# EAGLE design power-shield-v210 (EAGLE 7.2.0)
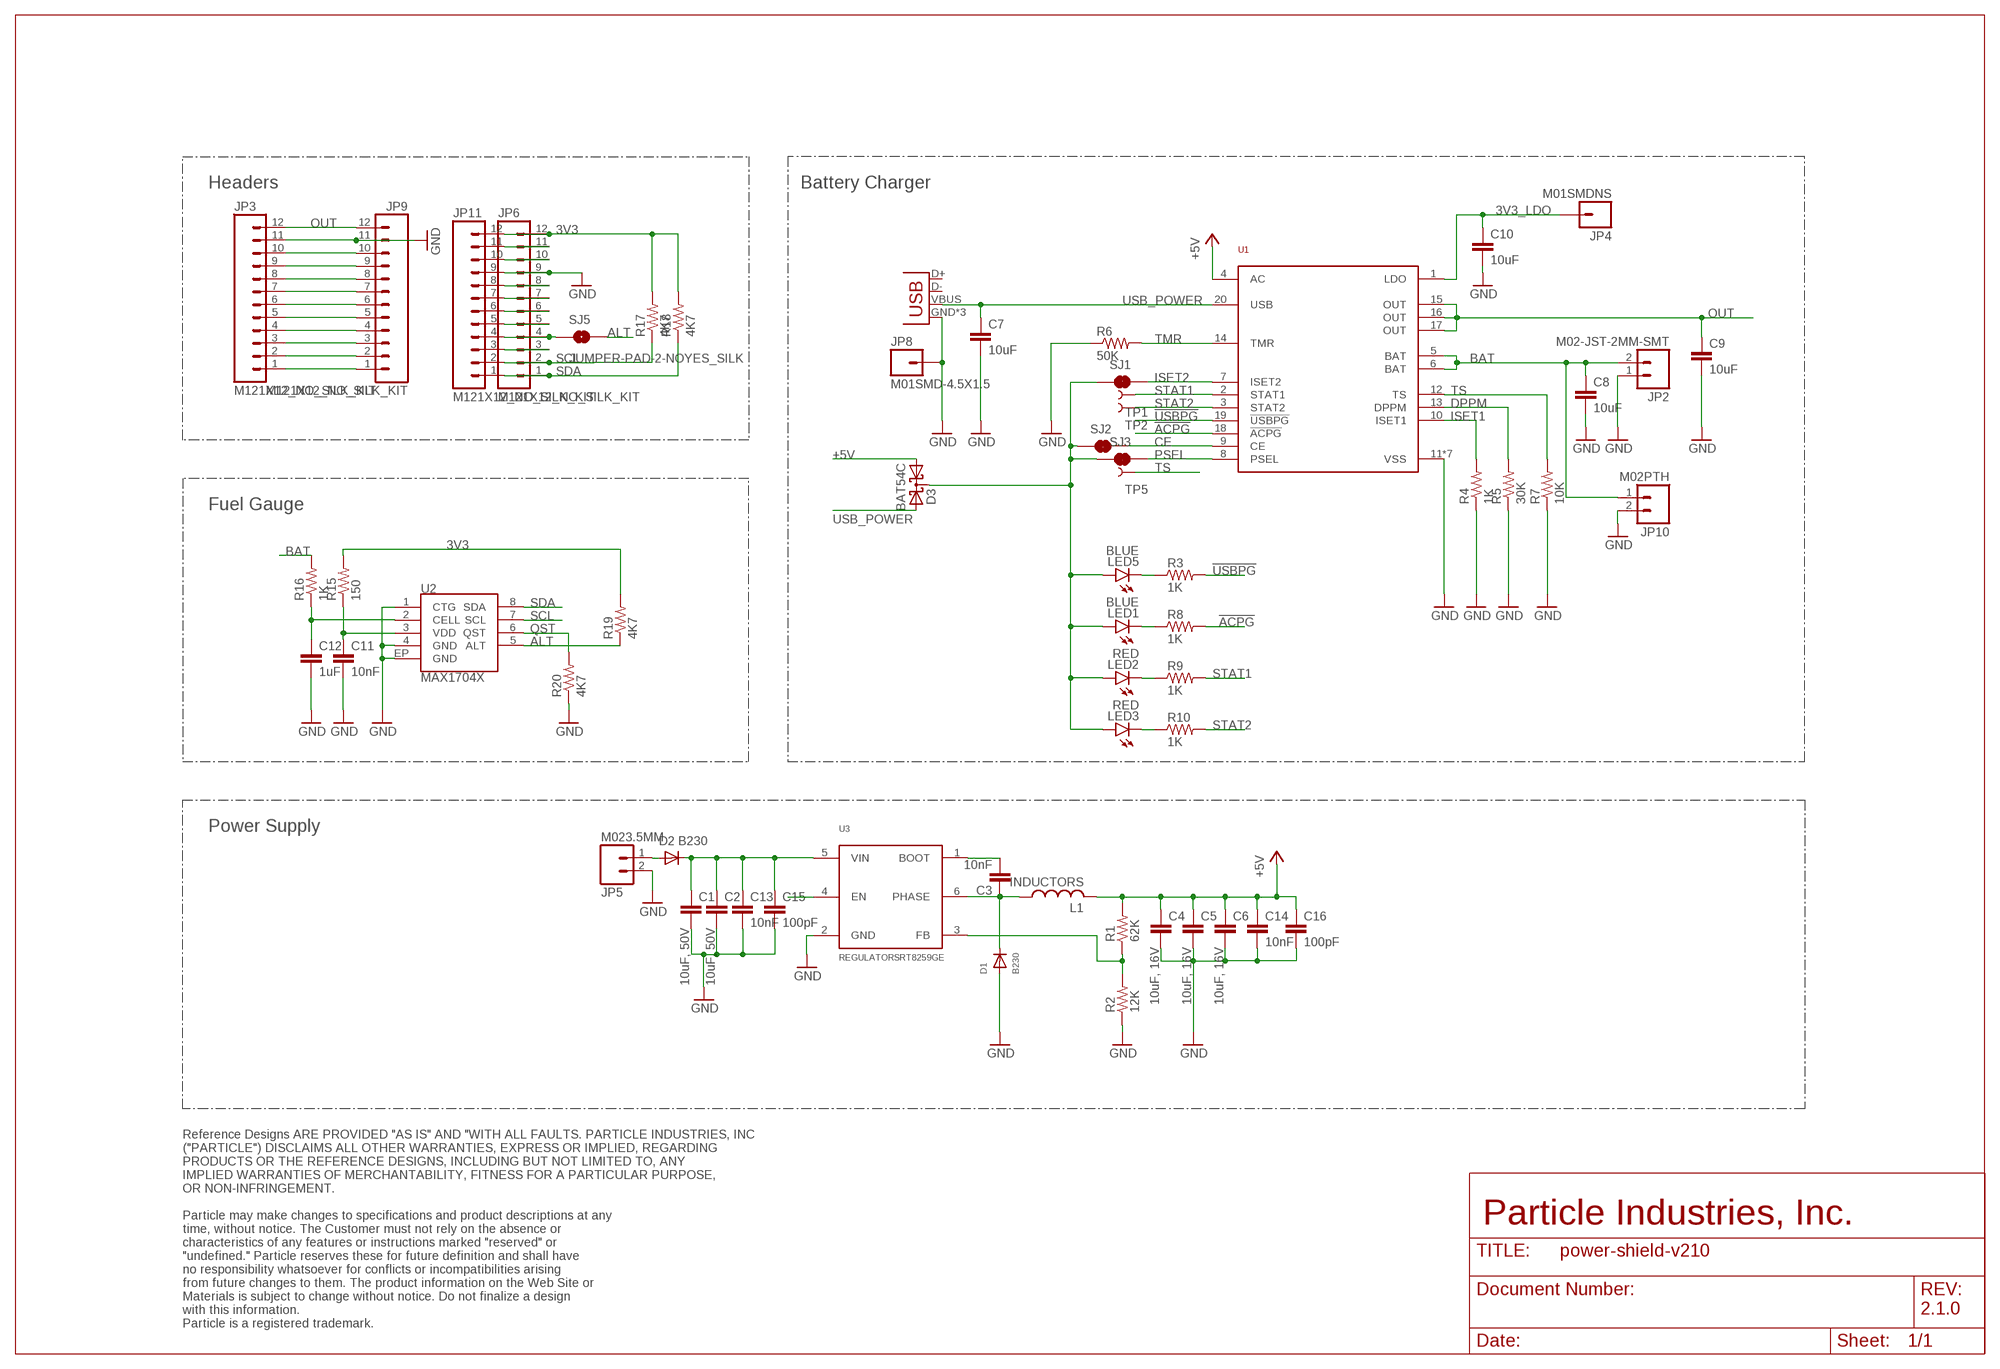
[diagram p0: schematic, sheet 1]

## Parts
C1  10uF, 50V  CAP1206  [1206]
C2  10uF, 50V  CAP1206  [1206]
C3  10nF  CAP0402-CAP  [0402-CAP]
C4  10uF, 16V  CAP1206  [1206]
C5  10uF, 16V  CAP1206  [1206]
C6  10uF, 16V  CAP1206  [1206]
C7  10uF  CAP0603-CAP  [0603-CAP]
C8  10uF  CAP0603-CAP  [0603-CAP]
C9  10uF  CAP0603-CAP  [0603-CAP]
C10  10uF  CAP0603-CAP  [0603-CAP]
C11  10nF  CAP0402-CAP  [0402-CAP]
C12  1uF  CAP0402-CAP  [0402-CAP]
C13  10nF  CAP0402-CAP  [0402-CAP]
C14  10nF  CAP0402-CAP  [0402-CAP]
C15  100pF  CAP0402-CAP  [0402-CAP]
C16  100pF  CAP0402-CAP  [0402-CAP]
D1  B230  DIODESMA  [SMADIODE]
D2  B230  DIODESMA  [SMADIODE]
D3  BAT54C  [SOT23]
JP1  USBUSB-MICROB-SLOT-HOLE  [USB-MICROB-SLOT-HOLE]
JP2  M02-JST-2MM-SMT  [JST-2-SMD]
JP3  M121X12_NO_SILK_KIT  [1X12_NO_SILK_KIT]
JP4  M01SMDNS  [1X01NS]
JP5  M023.5MM  [SCREWTERMINAL-3.5MM-2]
JP6  M121X12_NO_SILK_KIT  [1X12_NO_SILK_KIT]
JP8  M01SMD-4.5X1.5  [PAD-1.5X4.5]
JP9  M121X12_NO_SILK_KIT  [1X12_NO_SILK_KIT]
JP10  M02PTH  [1X02]
JP11  M121X12_NO_SILK_KIT  [1X12_NO_SILK_KIT]
L1  INDUCTORS  [NR8040T6R8N]
LED1  BLUE  LED0603  [LED-0603]
LED2  RED  LED0603  [LED-0603]
LED3  RED  LED0603  [LED-0603]
LED5  BLUE  LED0603  [LED-0603]
R1  62K  RESISTOR0603-RES  [0603-RES]
R2  12K  RESISTOR0603-RES  [0603-RES]
R3  1K  RESISTOR0402-RES  [0402-RES]
R4  1K  RESISTOR0402-RES  [0402-RES]
R5  30K  RESISTOR0402-RES  [0402-RES]
R6  50K  RESISTOR0402-RES  [0402-RES]
R7  10K  RESISTOR0402-RES  [0402-RES]
R8  1K  RESISTOR0402-RES  [0402-RES]
R9  1K  RESISTOR0402-RES  [0402-RES]
R10  1K  RESISTOR0402-RES  [0402-RES]
R15  150  RESISTOR0603-RES  [0603-RES]
R16  1K  RESISTOR0603-RES  [0603-RES]
R17  4K7  RESISTOR0402-RES  [0402-RES]
R18  4K7  RESISTOR0402-RES  [0402-RES]
R19  4K7  RESISTOR0402-RES  [0402-RES]
R20  4K7  RESISTOR0402-RES  [0402-RES]
SJ1  JUMPER-PAD-2-NC_BY_TRACE  [PAD-JUMPER-2-NC_BY_TRACE_YES_SILK]
SJ2  JUMPER-PAD-2-NC_BY_TRACE  [PAD-JUMPER-2-NC_BY_TRACE_YES_SILK]
SJ3  JUMPER-PAD-2-NC_BY_TRACE  [PAD-JUMPER-2-NC_BY_TRACE_YES_SILK]
SJ5  JUMPER-PAD-2-NOYES_SILK  [PAD-JUMPER-2-NO_YES_SILK]
TP1  TEST-POINT3  [PAD.03X.03]
TP2  TEST-POINT3  [PAD.03X.03]
TP5  TEST-POINT3  [PAD.03X.03]
U1  BQ24030BQ24030  [R-PVQFN-N20]
U2  MAX1704X  [TDFN-8]
U3  REGULATORSRT8259GE  [SOT23-6]

## Nets
3V3: JP6.12 JP11.12 R15.2 R17.2 R18.2 R19.2
3V3_LDO: C10.1 JP4.1 U1.1(LDO)
!ACPG: R8.2 U1.18(!ACPG)
!USBPG: R3.2 U1.19(!USBPG)
+5V: C4.1 C5.1 C6.1 C14.1 C16.1 D3.1(A1) L1.P$2 R1.2 U1.4(AC)
ALT: R19.1 SJ5.2 U2.5(ALT)
BAT: C8.1 JP2.2 JP10.1 R16.2 U1.5(BAT) U1.6(BAT)
CE: SJ2.2 U1.9(CE)
DPPM: R5.2 U1.13(DPPM)
GND: C1.2 C2.2 C4.2 C5.2 C6.2 C7.2 C8.2 C9.2 C10.2 C11.2 C12.2 C13.2 C14.2 C15.2 C16.2 D1.A JP1.GND JP1.MT1(GND) JP1.MT2(GND) JP2.1 JP3.11 JP5.2 JP6.9 JP8.P$1 JP9.11 JP10.2 JP11.9 R2.1 R4.1 R5.1 R6.1 R7.1 R20.1 U1.11(VSS) U1.21(VSS) U1.22(VSS) U1.23(VSS) U1.24(VSS) U1.25(VSS) U1.26(VSS) U2.1(CTG) U2.4(GND) U2.EP(GND) U3.2(GND)
ISET1: R4.2 U1.10(ISET1)
ISET2: SJ1.2 U1.7(ISET2)
N$1: LED5.C R3.1
N$2: D3.3(CC) LED1.A LED2.A LED3.A LED5.A SJ1.1 SJ2.1 SJ3.1
N$3: LED3.C R10.1
N$4: LED2.C R9.1
N$5: LED1.C R8.1
N$6: JP6.4 JP11.4 SJ5.1
N$7: JP3.1 JP9.1
N$8: JP3.2 JP9.2
N$9: U3.4(EN)
N$10: JP3.3 JP9.3
N$11: C12.1 R16.1 U2.2(CELL)
N$12: C11.1 R15.1 U2.3(VDD)
N$13: JP3.4 JP9.4
N$14: C1.1 C2.1 C13.1 C15.1 D2.C U3.5(VIN)
N$15: JP3.5 JP9.5
N$16: JP3.6 JP9.6
N$17: JP3.7 JP9.7
N$18: JP3.8 JP9.8
N$19: JP3.9 JP9.9
N$20: JP3.10 JP9.10
N$21: JP6.11 JP11.11
N$22: JP6.10 JP11.10
N$23: JP6.8 JP11.8
N$24: JP6.7 JP11.7
N$25: JP6.6 JP11.6
N$26: JP6.5 JP11.5
N$27: JP6.3 JP11.3
N$32: D2.A JP5.1
N$35: C3.1 D1.C L1.P$1 U3.6(PHASE)
N$36: C3.2 U3.1(BOOT)
N$144: R1.1 R2.2 U3.3(FB)
OUT: C9.1 JP3.12 JP9.12 U1.15(OUT) U1.16(OUT) U1.17(OUT)
PSEL: SJ3.2 U1.8(PSEL)
QST: R20.2 U2.6(QST)
SCL: JP6.2 JP11.2 R17.1 U2.7(SCL)
SDA: JP6.1 JP11.1 R18.1 U2.8(SDA)
STAT1: R9.2 TP1.P$1 U1.2(STAT1)
STAT2: R10.2 TP2.P$1 U1.3(STAT2)
TMR: R6.2 U1.14(TMR)
TS: R7.2 TP5.P$1 U1.12(TS)
USB_POWER: C7.1 D3.2(A2) JP1.VBUS U1.20(USB)
Unconnected: JP1.D+ JP1.D-

## Notes on the sheet
- Headers | Battery Charger
- Fuel Gauge
- Power Supply
- Particle Industries, Inc.
- 2.1.0
- Reference Designs ARE PROVIDED "AS IS" AND "WITH ALL FAULTS. PARTICLE INDUSTRIES, INC 
  ("PARTICLE") DISCLAIMS ALL OTHER WARRANTIES, EXPRESS OR IMPLIED, REGARDING 
  PRODUCTS OR THE REFERENCE DESIGNS, INCLUDING BUT NOT LIMITED TO, ANY 
  IMPLIED WARRANTIES OF MERCHANTABILITY, FITNESS FOR A PARTICULAR PURPOSE,
  OR NON-INFRINGEMENT.
  
  Particle may make changes to specifications and product descriptions at any 
  time, without notice. The Customer must not rely on the absence or 
  characteristics of any features or instructions marked "reserved" or 
  "undefined." Particle reserves these for future definition and shall have 
  no responsibility whatsoever for conflicts or incompatibilities arising 
  from future changes to them. The product information on the Web Site or 
  Materials is subject to change without notice. Do not finalize a design 
  with this information. 
  Particle is a registered trademark.

## Library data of the parts
C1-C16 = SparkFun-Capacitors:CAP: Capacitor Standard 0603 ceramic capacitor, and 0.1" leaded capacitor.
D1 D2 = adafruit:DIODE: Diode SMADIODE - SMA Surface Mount Package 20V 1A Schottky Diode Digikey: 641-1014-6-ND DO-1N4148 - Through Hole Small Current Diode SOD-123 20V 1 A (.5mV Vf) Schottky Diode - Digikey: MBRX120TPMSCT-ND SOD-323 10V 570mA (.38mV Vf, 3ns) Schottky Diode - Digikey: ZLLS410CT-ND SOD-523 30V 30mA Schottky Diode (RB751S-40TE61) - Digikey: RB751S-40TE61CT-ND SOT23-R/W - SOT23 Package (R = Solder Paste/Reflow Ovens, W = Hand-Soldering) BAT54Film 40V 300mA - Digikey: 497-7162-1-ND
D3 = diode:BAT54C: Schottky Diodes Source: Fairchild .. BAT54.pdf
JP1 = Spark:USB
JP2 = SparkFun-Connectors:M02: Standard 2-pin 0.1" header. Use with - straight break away headers ( PRT-00116) - right angle break away headers (PRT-00553) - swiss pins (PRT-00743) - machine pins (PRT-00117) - female headers (PRT-00115) Molex polarized connector foot print use with: PRT-08233 with associated crimp pins and housings. 2.54_SCREWTERM for use with PRT-10571. 3.5mm Screw Terminal footprints for PRT-08084 5mm Screw Terminal footprints for use with PRT-08433; PROD_ID: CONN-08352
JP3 JP6 JP9 JP11 = SparkFun-Connectors:M12: Header 12 Standard 12-pin 0.1" header. Use with straight break away headers (SKU : PRT-00116), right angle break away headers (PRT-00553), swiss pins (PRT-00743), machine pins (PRT-00117), and female headers (PRT-00115).
JP4 JP8 = SparkFun-Connectors:M01: Header 1 Standard 1-pin 0.1" header. Use with straight break away headers (SKU : PRT-00116), right angle break away headers (PRT-00553), swiss pins (PRT-00743), machine pins (PRT-00117), and female headers (PRT-00115).
JP5 JP10 = SparkFun-Connectors:M02: Standard 2-pin 0.1" header. Use with - straight break away headers ( PRT-00116) - right angle break away headers (PRT-00553) - swiss pins (PRT-00743) - machine pins (PRT-00117) - female headers (PRT-00115) Molex polarized connector foot print use with: PRT-08233 with associated crimp pins and housings. 2.54_SCREWTERM for use with PRT-10571. 3.5mm Screw Terminal footprints for PRT-08084 5mm Screw Terminal footprints for use with PRT-08433
L1 = mohit-eagle:INDUCTORS
LED1-LED3 LED5 = SparkFun-LED:LED: LEDs Standard schematic elements and footprints for 5mm, 3mm, 1206, and 0603 sized LEDs. 5mm - Spark Fun Electronics SKU : COM-00529 (and others)
R1-R10 R15-R20 = SparkFun-Passives:RESISTOR: Resistor Basic schematic elements and footprints for 0603, 1206, and PTH resistors.
SJ1-SJ3 = mohit-eagle:JUMPER-PAD-2-NC_BY_TRACE
SJ5 = SparkFun-Passives:JUMPER-PAD-2-NO
TP1 TP2 TP5 = SparkFun-Passives:TEST-POINT: Bare copper test points for troubleshooting or ICT
U1 = mohit-eagle:BQ24030
U2 = SparkFun-PowerIC:MAX1704X: MAX17043/MAX17044: Battery Fuel Guage (43 is 1cell, 44 is 2cell)
U3 = mohit-eagle:REGULATORS

## Board
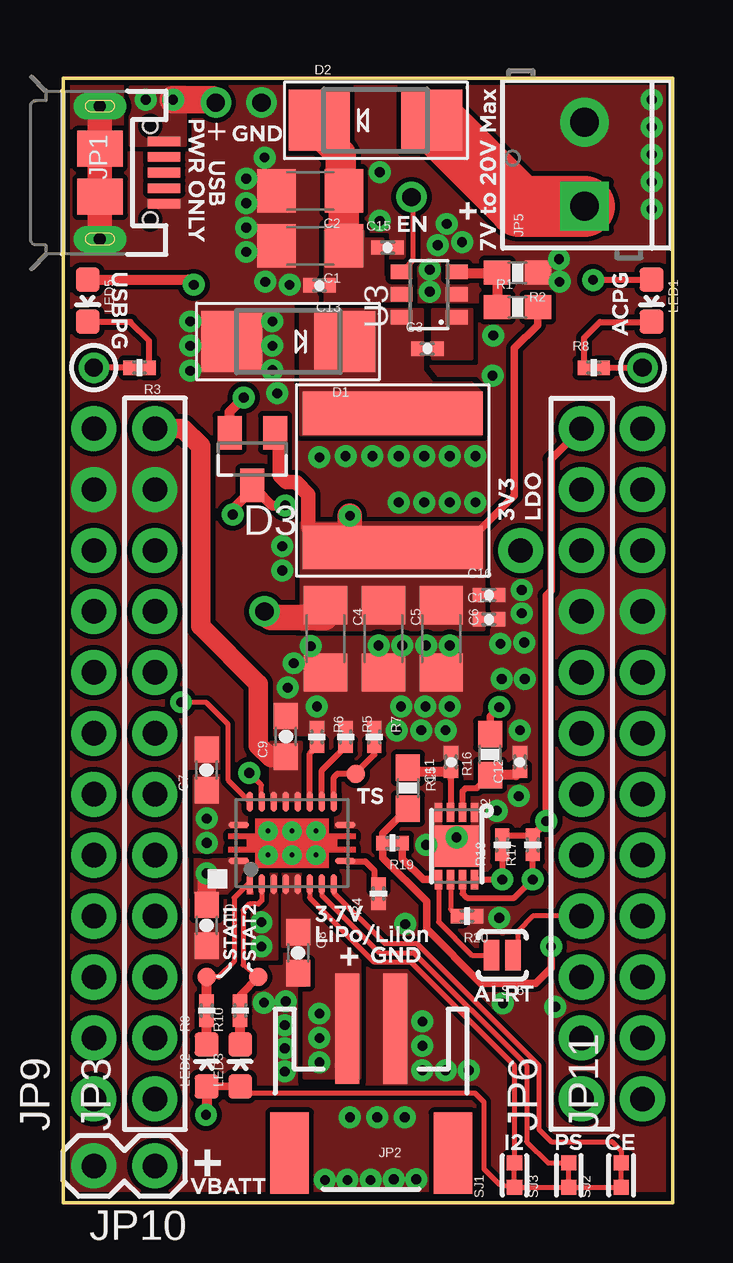
[diagram p1: board, top side]
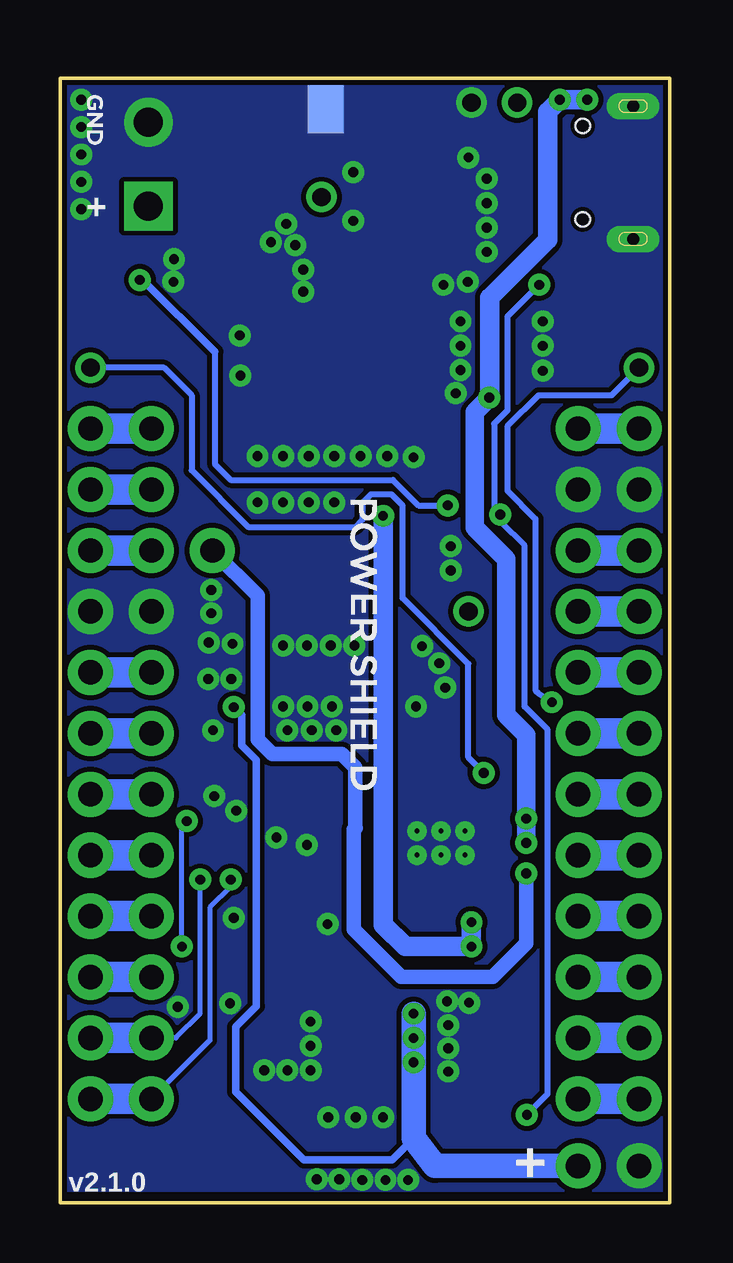
[diagram p2: board, bottom side, seen from below]

Size 25.4 x 46.86 mm. Coordinates in mm from the lower left corner, seen from the top.
Outline: 0,0 0,46.86 25.4,46.86 25.4,0 0,0
Copper layers (1*16): Top 0.035mm / dielectric 1.5mm / Bottom 0.035mm
Design rules "SparkFun-2-layer": minimum track width 7mil, minimum drill 15mil, track to track 8mil, track to pad 8mil, pad to pad 8mil, via to via 8mil, smd to smd 8mil, copper to edge 8mil, drill to drill 8mil, minimum pad ring 12mil, minimum via ring 10mil, stop-mask expansion 4mil, vias tented up to drill 20mil, thermal gap 10mil

### Footprints (pad centres in the part's own frame; a part is rotated, then mirrored left to right if it is on the bottom)
1206 = smd 1.6 x 1.8: 1 -1.4,0; 2 1.4,0
0402-CAP = smd 0.55 x 0.6: 1 -0.4,0; 2 0.4,0
0603-CAP = smd 1.1 x 1: 1 -0.85,0; 2 0.85,0
SMADIODE = smd 2.54 x 2.54: A 2.349,0; C -2.349,0
SOT23 = smd 1 x 1.4: 1 -0.95,-1.1; 2 0.95,-1.1; 3 0,1.1
USB-MICROB-SLOT-HOLE = smd 0.4 x 1.35: D+ 0,2.675; D- -0.65,2.675; GND 1.3,2.675; ID 0.65,2.675; VBUS -1.3,2.675 | drill 0.5 pad 1.1 long: MT1 -2.775,0; MT2 2.775,0 | smd 1.5 x 1.9: P$1 -1,0; P$2 1,0.01 | hole 0.6: -1.95,2.1; 1.95,2.1
JST-2-SMD = smd 1 x 4.6: 1 -1,-3.7; 2 1,-3.7 | smd 1.6 x 3.4: NC1 -3.4,1.5; NC2 3.4,1.5
1X12_NO_SILK_KIT = drill 1.016 pad 1.88: 1 0,0; 2 2.54,0; 3 5.08,0; 4 7.62,0; 5 10.16,0; 6 12.7,0; 7 15.24,0; 8 17.78,0; 9 20.32,0; 10 22.86,0; 11 25.4,0; 12 27.94,0
1X01NS = drill 1.016 pad 1.88: 1 0,0
SCREWTERMINAL-3.5MM-2 = drill 1.2 pad 2.032 square: 1 0,0 | drill 1.2 pad 2.032: 2 3.5,0
PAD-1.5X4.5 = smd 1.5 x 2: P$1 0,0
1X02 = drill 1.016 pad 1.88: 1 0,0; 2 2.54,0
NR8040T6R8N = smd 1.8 x 7.5: P$1 -2.8,0; P$2 2.8,0
LED-0603 = smd 1 x 1: A 0,-0.877; C 0,0.877
0603-RES = smd 1.1 x 1: 1 -0.85,0; 2 0.85,0
0402-RES = smd 0.55 x 0.6: 1 -0.4,0; 2 0.4,0
PAD-JUMPER-2-NC_BY_TRACE_YES_SILK = smd 0.635 x 0.635: 1 -0.508,0; 2 0.508,0
PAD-JUMPER-2-NO_YES_SILK = smd 0.635 x 1.27: 1 -0.45,0; 2 0.45,0
PAD.03X.03 = smd 0.762 x 0.762: P$1 0,0
R-PVQFN-N20 = smd 0.85 x 0.28: 1 -2.22,-0.75; 10 2.22,-0.75; 11 2.22,0.75; 20 -2.22,0.75 | smd 0.28 x 0.85: 2 -1.75,-1.72; 3 -1.25,-1.72; 4 -0.75,-1.72; 5 -0.25,-1.72; 6 0.25,-1.72; 7 0.75,-1.72; 8 1.25,-1.72; 9 1.75,-1.72; 12 1.75,1.72; 13 1.25,1.72; 14 0.75,1.72; 15 0.25,1.72; 16 -0.25,1.72; 17 -0.75,1.72; 18 -1.25,1.72; 19 -1.75,1.72 | drill 0.2 pad 0.4: 21 1,0.5; 22 0,0.5; 23 -1,0.5; 24 -1,-0.5; 25 0,-0.5; 26 1,-0.5
TDFN-8 = smd 0.8 x 0.3: 1 -1.4,0.75; 2 -1.4,0.25; 3 -1.4,-0.25; 4 -1.4,-0.75; 5 1.4,-0.75; 6 1.4,-0.25; 7 1.4,0.25; 8 1.4,0.75 | smd 1.73 x 1.88: EP 0,0
SOT23-6 = smd 0.6 x 0.9: 1 -0.95,-1.15; 2 0,-1.15; 3 0.95,-1.15; 4 0.95,1.15; 5 0,1.15; 6 -0.95,1.15

### Placement (x,y rotation side)
C1  10.29,39.88 180 top
C2  10.29,42.16 180 top
C3  15.16,35.59 0 top
C4  10.92,23.5 270 top
C5  13.34,23.5 270 top
C6  15.75,23.5 270 top
C7  5.97,18.03 90 top
C8  9.78,10.41 270 top
C9  9.27,19.43 90 top
C10  5.97,11.56 270 top
C11  16.15,18.36 90 top
C12  19.02,18.36 90 top
C13  10.67,38.23 180 top
C14  17.73,24.31 0 top
C15  13.51,39.8 0 top
C16  17.73,25.32 0 top
D1  9.37,35.89 180 top
D2  13,45.11 0 top
D3  7.87,30.99 180 top
JP1  1.52,42.93 270 top
JP2  12.83,3.56 180 top
JP3  3.81,4.32 90 top
JP4  19.05,27.18 0 top
JP5  21.72,41.53 90 top
JP6  21.59,4.32 90 top
JP8  14.33,45.57 0 bottom
JP9  1.27,4.32 90 top
JP10  3.81,1.52 180 top
JP11  24.13,4.32 90 top
L1  13.72,30.1 270 top
LED1  24.51,37.59 180 top
LED2  5.97,5.71 0 top
LED3  7.37,5.71 0 top
LED5  1.02,37.59 180 top
R1  18.92,37.31 0 top
R2  18.92,38.76 180 top
R3  3.17,34.8 180 top
R4  13.13,12.88 90 top
R5  11.76,19.41 270 top
R6  10.57,19.41 270 top
R7  12.95,19.41 270 top
R8  22.1,34.8 0 top
R9  5.97,8 90 top
R10  7.37,8 90 top
R15  14.35,17.27 270 top
R16  17.78,18.67 90 top
R17  19.56,14.91 90 top
R18  18.29,14.91 90 top
R19  13.72,14.99 180 top
R20  16.81,11.94 180 top
SJ1  18.8,1.14 90 top
SJ2  23.24,1.14 90 top
SJ3  21.06,1.14 90 top
SJ5  18.29,10.31 180 top
TP1  5.97,9.4 0 top
TP2  8.13,9.4 0 top
TP5  12.19,17.86 0 top
U1  9.53,14.99 0 top
U2  16.38,14.86 270 top
U3  15.24,37.85 90 top

### Tracks (layer width: path | path; a pad name or v marks a point on that pad's centre or on a via)
3V3  (via drill 0.41)
  Top 0.254: R18.2 R17.2
  Top 0.305: JP6.12 20.32,30.99 20.32,25.5 20.12,25.3 v20.12,15.9 20.12,15.87 R17.2 | v20.32,10.67 20.32,9.78 19.68,9.14 17.4,9.14 15.14,11.4 15.14,12.55 13.32,14.37 R19.2 13.32,15.39 R15.2
  Bottom 0.203: v20.32,10.67 20.32,15.7 v20.12,15.9
  Bottom 1.27: JP6.12 JP11.12
3V3_LDO  (via drill 0.41)
  Top 0.305: 6.1,12.53 C10.1
  Top 0.762: C10.1 v5.97,13.72
  Bottom 0.305: 13.11,15.65 13.08,15.62
  Bottom 0.61: v5.97,13.72 5.97,10.79 7.37,9.4 11.18,9.4 13.16,11.38 13.16,15.54 13.08,15.62 | JP4.1 17.17,25.3 17.17,19.3 16.56,18.69 13.66,18.69 13.11,18.14 13.11,15.65
  Bottom 0.813: 19,27.13 JP4.1
  pour Top (rank 2, no thermals): 7.62,14.43 5.49,14.43 5.49,12.9 7.62,12.9
!ACPG  (via drill 0.41, 0.76)
  Top 0.203: U1.18 8.26,16.73 8.26,17.4 v7.75,17.91
  Top 0.254: R8.2 v24.13,34.8
  Bottom 0.254: v7.75,17.91 8.38,18.54 8.38,22.45 11.12,25.2 11.12,29.06 11.58,29.52 12.45,29.52 12.8,29.16 12.8,28.45 13.11,28.14 17.53,28.14 19.91,30.53 19.91,33.66 21.06,34.8 v24.13,34.8
!USBPG  (via drill 0.41, 0.76)
  Top 0.203: U1.19 6.86,17.62 6.86,19.94 5.94,20.85 v4.9,20.85
  Top 0.254: R3.2 v1.27,34.8
  Bottom 0.254: 5.54,21.29 5.48,21.25 | 5.48,21.25 v4.9,20.85 | 5.48,21.25 5.59,21.35 5.59,28.5 6.76,29.67 6.76,32.36 5.46,33.66 2.41,33.66 v1.27,34.8
+5V  (via drill 0.41, 0.76)
  Top 0.305: 9.02,31.89 D3.1 | 17.27,27.94 18.8,29.46 18.8,35.61 19.76,36.58 R1.2
  Top 0.61: 9.02,31.89 9.02,30.3 9.3,30.02 9.7,30.02 10.21,29.52 10.21,28.14 10.54,27.81
  Top 1.016: 10.54,27.81 11.94,27.81 v11.94,28.63
  Top 1.067: v8.38,24.64 8.64,24.38 10.92,24.38 C4.1
  Bottom 0.813: 8.28,11.73 8.26,11.71 v8.26,10.67 11.02,10.67 11.94,11.58 v11.94,28.63
  other vias: 8.26,11.68
  pour Top (no thermals): 9.91,23.88 9.91,28.32 17.53,28.32 17.53,23.88
  pour Top (no thermals): 8.89,13.72 7.75,13.72 7.75,10.16 8.89,10.16
ALT
  Top 0.203: U2.5 15.63,11.7 17.02,10.31 SJ5.2 17.84,10.16
  Top 0.305: U2.5 14.99,13.46 14.12,14.33 R19.1
BAT  (via drill 0.41)
  Top 0.305: R16.2 17.78,20.27 v18.16,20.65
  Top 0.762: 11.68,5.71 11.81,5.84
  Bottom 0.305: 10.67,2.67 11.56,1.78 15.24,1.78 18.09,4.62 18.09,7.32 17.22,8.18 17.22,18.44 17.83,19.05 17.83,20.32 v18.16,20.65
  Bottom 1.016: JP10.1 9.78,1.52 10.67,2.67 v10.67,5.84 v10.67,6.86 v10.67,7.87
  pour Top (no thermals): 9.14,13.72 9.14,10.67 10.03,10.67 10.03,5.21 12.34,5.21 12.34,13.72
CE
  Top 0.203: U1.9 11.28,12.91 13.39,10.79 14.73,10.79 19.81,5.71 19.81,3.05 20.32,2.54 22.86,2.54 23.24,2.16 SJ2.2
DPPM
  Top 0.254: U1.13 10.78,18.02 R5.2
GND  (via drill 0.41, 0.76)
  Top 1.016: 1.52,40.28 1.52,45.47
  other vias: 10.31,23.19 9.6,22.48 7.62,39.62 13.97,29.18 15.04,29.18 16.1,29.18 17.17,29.18 12.88,31.11 9.27,8.38 8.36,8.33 11.84,0.94 12.8,0.94 13.77,0.97 15.27,37.97 10.9,0.94 9.12,26.34 5.28,34.67 9.22,5.46 5.28,35.71 19.2,23.34 14.07,20.68 14.96,5.51 15.93,5.51 16.89,5.51 14.96,6.53 14.96,7.54 14.71,0.97 17.17,31.11 16.1,31.11 15.04,31.11 13.97,31.11 11.76,31.11 9.12,27.36 24.51,45.97 24.51,44.83 24.51,43.69 24.51,42.55 24.51,41.4 18.21,23.29 19.1,24.56 19.1,25.53 13.08,3.56 14.22,3.56 11.94,3.56 15.09,20.68 16.1,20.68 20.5,8.15 15.93,19.68 7.62,41.66 7.62,40.64 7.62,42.67 8.71,36.73 8.71,35.71 8.71,34.7 8.92,33.73 15.11,14.91 16.38,15.21 13.13,23.22 14.12,23.22 15.11,23.22 16.1,23.22 13.89,19.68 14.91,19.68 20.68,38.38 5.28,36.73 15.27,38.89 13.18,42.95 17.91,36.14 17.88,34.47 18.26,21.82 19.23,21.82 18.16,11.86 19.02,19.68 18.06,16.33 18.97,16.94 9.35,21.46 10.57,20.68 9.42,38.25 13.18,40.92 10.67,31.06 20.65,39.32 9.22,6.43 9.22,7.39 14.25,11.61 18.31,8.31 8.38,43.56 8.41,38.38 15.98,40.79 16.61,40.03 15.6,39.9 8.26,45.85
  pour Bottom (rank 3, no thermals): 0,0.51 25.4,0.51 25.4,46.86 0,46.86
  pour Top (rank 3, no thermals): 0,0.51 25.4,0.51 25.4,46.86 0,46.86
ISET1
  Top 0.254: U1.10 11.76,14.22 12.57,14.22 12.95,13.84 12.95,13.46 R4.2
ISET2
  Top 0.203: U1.7 10.26,13.25 10.26,12.7 12.93,10.03 14.48,10.03 18.8,5.71 SJ1.2
N$1
  Top 0.254: R3.1 3.58,35.92 2.79,36.7 LED5.C
N$2  (via drill 0.41)
  Top 0.203: LED3.A 7.63,4.57 17.14,4.57 17.53,4.19 17.53,1.4 18.16,0.76 SJ1.1 SJ3.1 SJ2.1
  Top 0.254: 7.87,29.72 D3.3 | v22.07,38.46 v22.07,38.47 LED1.A
  Top 0.305: LED2.A LED3.A | 5.97,3.68 v5.94,3.66
  Top 0.406: LED2.A 5.97,3.68 | v7.06,28.68 7.06,28.91 7.87,29.72 8.03,29.72 8.69,29.06 v9.25,29.06 | LED5.A 5.22,38.47 v5.44,38.25
  Bottom 0.254: v5.94,3.66 5.08,4.52 5.08,19.71 6.04,20.68 6.04,27.38 7.04,28.37 7.04,28.65 v7.06,28.68 7.32,28.93 7.32,32.46 6.76,33.02 6.76,36.93 v5.44,38.25 | 18.95,35.46 18.95,30.79 18.29,30.12 11.53,30.12 10.46,29.06 v9.25,29.06
  Bottom 0.305: 18.95,35.46 21.95,38.46 v22.07,38.46
N$3
  Top 0.406: LED3.C R10.1
N$4
  Top 0.406: LED2.C R9.1
N$5
  Top 0.254: R8.1 21.7,36.05 22.35,36.7 24.5,36.7 LED1.C
N$6
  Top 0.203: JP6.4 19.56,11.94 18.92,11.3 18.92,10.5 SJ5.1
  Bottom 1.27: JP6.4 JP11.4
N$7
  Bottom 1.27: JP3.1 JP9.1
N$8
  Bottom 1.27: JP3.2 JP9.2
N$9  (via drill 0.76)
  Top 0.203: U3.4 14.58,39.29 14.58,41.81 14.5,41.88 v14.5,41.91
N$10
  Bottom 1.27: JP3.3 JP9.3
N$11
  Top 0.254: 17.96,17.64 R16.1 17.23,17.27 16.76,17.27 16.63,17.14 U2.2 | C12.1 18.85,17.82
  Top 0.406: 18.85,17.82 R16.1
N$12
  Top 0.254: 14.51,17.96 R15.1 | C11.1 16.13,17.64 U2.3
  Top 0.406: 14.51,17.96 C11.1
N$13
  Bottom 1.27: JP9.4 JP3.4
N$14
  Top 1.27: D2.C 10.29,44.96 11.56,43.69 11.56,42.17 C2.1 C1.1
  pour Top (no thermals): 14.5,37.59 10.92,37.59 10.92,40.51 12.5,40.49 12.5,40.16 13.31,40.16 13.31,38.56 14.5,38.56
N$15
  Bottom 1.27: JP9.5 JP3.5
N$16
  Bottom 1.27: JP9.6 JP3.6
N$17
  Bottom 1.27: JP9.7 JP3.7
N$18
  Bottom 1.27: JP9.8 JP3.8
N$19
  Bottom 1.27: JP9.9 JP3.9
N$20
  Bottom 1.27: JP9.10 JP3.10
N$21
  Bottom 1.27: JP6.11 JP11.11
N$22
  Bottom 1.27: JP6.10 JP11.10
N$23
  Bottom 1.27: JP6.8 JP11.8
N$24
  Bottom 1.27: JP6.7 JP11.7
N$25
  Bottom 1.27: JP6.6 JP11.6
N$26
  Bottom 1.27: JP6.5 JP11.5
N$27
  Bottom 1.27: JP6.3 JP11.3
N$32
  Top 1.27: 15.3,45.09 D2.A
  Top 1.93: 15.43,45.09 D2.A
  Top 2.54: 15.43,45.09 18.99,41.53 JP5.1
N$35
  pour Top (no thermals): 14.96,37.21 9.88,37.21 9.88,32 17.4,32 17.4,33.78 17.02,34.16 15.37,34.16 14.96,34.67
N$36
  pour Top (no thermals): 15.39,35.18 15.39,37.21 17.02,37.21 17.02,35.18
N$144
  Top 0.305: U3.3 16.45,38.73 | 18.05,38.73 R2.2
  Top 0.406: 16.45,38.73 18.05,38.73 | R2.2 R1.1
OUT
  Top 0.762: 8.13,21.59 8.13,21.61
  Top 0.813: C9.1 9.23,18.54 8.64,18.54 8.13,19.05 8.13,21.59 | 8.13,21.61 5.71,24.03 5.71,31.52 4.98,32.26 JP3.12
  Bottom 1.27: JP9.12 JP3.12
  pour Top (no thermals): 8.64,16.76 9.91,16.76 9.91,19.18 8.64,19.18
PSEL
  Top 0.203: U1.8 10.77,12.8 13.16,10.41 14.61,10.41 19.3,5.71 19.3,2.54 20.19,1.65 SJ3.2
QST
  Top 0.203: U2.6 16.13,12.22 R20.2
SCL  (via drill 0.41)
  Top 0.254: R17.1 v19.56,13.46 18.8,12.7 16.82,12.7 16.63,12.88 U2.7
  Bottom 0.203: JP6.2 20.57,6.86 19.56,7.87 v19.56,13.46
  Bottom 1.27: JP6.2 JP11.2
SDA  (via drill 0.41)
  Top 0.254: U2.8 17.78,13.46 v18.29,13.46 R18.1
  Bottom 0.203: v18.29,13.46 18.29,13.16 19.15,12.29 19.15,6.76 JP6.1
  Bottom 1.27: JP6.1 JP11.1
STAT1
  Top 0.203: U1.2 7.68,13.27 7.11,12.7 7.11,10.03 6.48,9.4 TP1.P$1
  Top 0.406: R9.2 TP1.P$1
STAT2
  Top 0.203: U1.3 8.28,12.59 8.13,12.45 7.75,12.45 7.49,12.19 7.49,9.91 TP2.P$1
  Top 0.305: TP2.P$1 7.37,8.64 R10.2
TMR
  Top 0.254: U1.14 10.28,18.71 R6.2
TS
  Top 0.254: U1.12 11.28,17.73 11.43,17.88 12.17,17.88 | 12.17,17.88 TP5.P$1 | 12.17,17.88 12.95,18.67 R7.2
USB_POWER  (via drill 0.41, 0.76)
  Top 0.406: D3.2 6.92,32.96 v7.52,33.55
  Top 0.813: D3.2 6.86,31.9
  Top 1.143: v6.35,45.85 6.22,45.97 v4.57,45.97
  Bottom 0.762: v5.97,14.99 v5.97,16 5.97,19.48 6.81,20.32 6.81,26.82 8.13,28.14 8.13,32.94 v7.52,33.55
  Bottom 0.813: v7.52,33.55 7.49,33.58 7.49,37.72 5.08,40.13 5.08,45.47 v4.57,45.97 v3.43,45.97
  pour Top (no thermals): 2.79,44.07 5.08,44.07 5.08,46.48 2.79,46.48
  pour Top (no thermals): 7.62,14.61 5.46,14.61 5.46,17.78 7.62,17.78

### Text on the board
tPlace: + | + | + | +
bPlace: + | + | v2.1.0
bStop: MSB
tDocu: Reference Designs ARE PROVIDED "AS IS" AND "WITH ALL FAULTS. PARTICLE INDUSTRIES, INC / ("PARTICLE") DISCLAIMS ALL OTHER WARRANTIES, EXPRESS OR IMPLIED, REGARDING / PRODUCTS OR THE REFERENCE DESIGNS, INCLUDING BUT NOT LIMITED TO, ANY / IMPLIED WARRANTIES OF MERCHANTABILITY, FITNESS FOR A PARTICULAR PURPOSE, / OR NON-INFRINGEMENT. / / Particle may make changes to specifications and product descriptions at any / time, without notice. The Customer must not rely on the absence or / characteristics of any features or instructions marked "reserved" or / "undefined." Particle reserves these for future definition and shall have / no responsibility whatsoever for conflicts or incompatibilities arising / from future changes to them. The product information on the Web Site or / Materials is subject to change without notice. Do not finalize a design / with this information. / Particle is a registered trademark.